# EAGLE design mapleSDuino-V0.1_011-eagle7 (EAGLE 7.6.0)
MAPLE-CUx Large Version
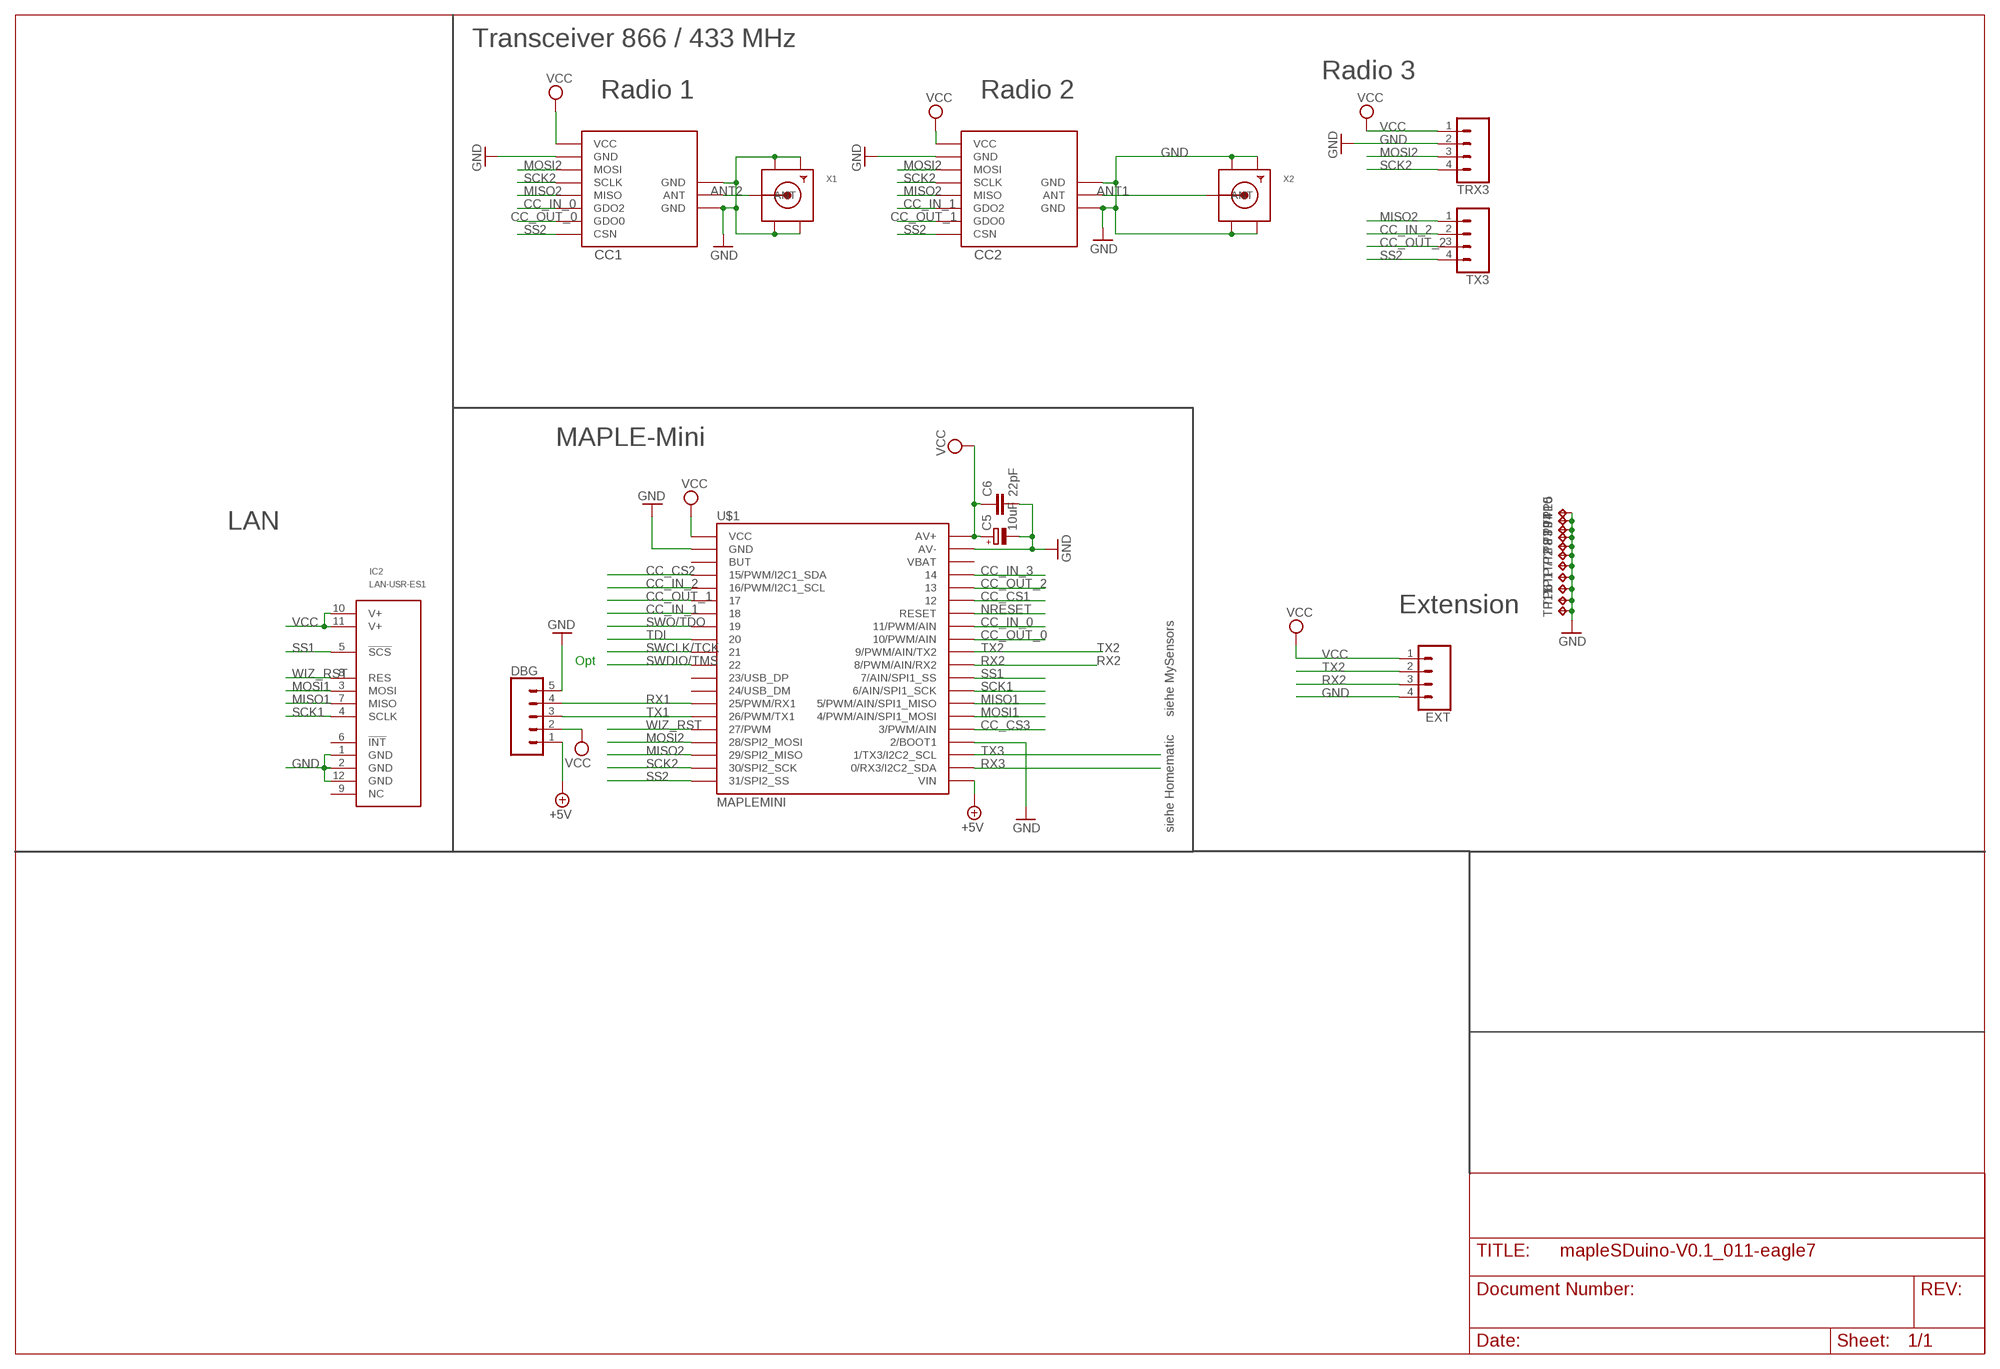
[diagram p0: schematic, sheet 1]

## Parts
C5  10uF  CPOL-EUR/2012-12W  [R/2012-12W]
C6  22pF  C-EUC0805  [C0805]
CC1  CC1101  CC1101_MODULE1SMD  [CC1101_MODULE1_SMD]
CC2  CC1101_MODULE1SMD  [CC1101_MODULE1_SMD]
DBG  CONN_05LOCK  [1X05_LOCK]
EXT  CONN_04PTH  [1X04]
IC2  LAN-USR-ES1  [USR-ES1]
TP1  TPTP06SQ  [TP06SQ]
TP2  TPTP06SQ  [TP06SQ]
TP3  TPTP06SQ  [TP06SQ]
TP4  TPTP06SQ  [TP06SQ]
TP5  TPTP06SQ  [TP06SQ]
TP6  TPTP06SQ  [TP06SQ]
TP7  TPTP06SQ  [TP06SQ]
TP8  TPTP06SQ  [TP06SQ]
TP9  TPTP06SQ  [TP06SQ]
TP10  TPTP06SQ  [TP06SQ]
TP11  TPTP06SQ  [TP06SQ]
TRX3  CONN_04PTH  [1X04]
TX3  CONN_04PTH  [1X04]
U$1  MAPLEMINI  [20-DIP]
X1  SMACONNECTOR_EDGE  [SMA_EDGELAUNCH]
X2  SMACONNECTOR_EDGE  [SMA_EDGELAUNCH]

## Nets
+5V [PWR]: DBG.1 U$1.21(VIN)
ANT1 [PWR]: CC2.ANT X2.P(ANT)
ANT2: CC1.ANT X1.P(ANT)
CC_CS1: U$1.35
CC_CS2: U$1.4(15/PWM/I2C1_SDA)
CC_CS3: U$1.25(3/PWM/AIN)
CC_IN_0: CC1.GDO2 U$1.33(11/PWM/AIN)
CC_IN_1: CC2.GDO2 U$1.7
CC_IN_2: TX3.2 U$1.5(16/PWM/I2C1_SCL)
CC_IN_3: U$1.37
CC_OUT_0: CC1.GDO0 U$1.32(10/PWM/AIN)
CC_OUT_1: CC2.GDO0 U$1.6
CC_OUT_2: TX3.3 U$1.36
GND [PWR]: C5.- C6.2 CC1.GND@0(GND) CC1.GND@1(GND) CC1.GND@2(GND) CC2.GND@0(GND) CC2.GND@1(GND) CC2.GND@2(GND) DBG.5 EXT.4 IC2.1(GND) IC2.2(GND) IC2.12(GND) TP1.TP TP2.TP TP3.TP TP4.TP TP5.TP TP6.TP TP7.TP TP8.TP TP9.TP TP10.TP TP11.TP TRX3.2 U$1.2(GND) U$1.24(2/BOOT1) U$1.39(AV-) X1.GND@1(GND4) X1.GND@2(GND3) X1.GND@3(GND2) X1.GND@4(GND1) X2.GND@1(GND4) X2.GND@2(GND3) X2.GND@3(GND2) X2.GND@4(GND1)
MISO1: IC2.7(MISO) U$1.27(5/PWM/AIN/SPI1_MISO)
MISO2: CC1.MISO CC2.MISO TX3.1 U$1.18(29/SPI2_MISO)
MOSI1: IC2.3(MOSI) U$1.26(4/PWM/AIN/SPI1_MOSI)
MOSI2: CC1.MOSI CC2.MOSI TRX3.3 U$1.17(28/SPI2_MOSI)
NRESET: U$1.34(RESET)
RX1: DBG.4 U$1.14(25/PWM/RX1)
RX2: EXT.3 U$1.30(8/PWM/AIN/RX2)
RX3: U$1.22(0/RX3/I2C2_SDA)
SCK1: IC2.4(SCLK) U$1.28(6/AIN/SPI1_SCK)
SCK2: CC1.SCLK CC2.SCLK TRX3.4 U$1.19(30/SPI2_SCK)
SS1: IC2.5(!SCS!) U$1.29(7/AIN/SPI1_SS)
SS2: CC1.CSN CC2.CSN TX3.4 U$1.20(31/SPI2_SS)
SWCLK/TCK: U$1.10
SWDIO/TMS: U$1.11
SWO/TDO: U$1.8
TDI: U$1.9
TX1: DBG.3 U$1.15(26/PWM/TX1)
TX2: EXT.2 U$1.31(9/PWM/AIN/TX2)
TX3: U$1.23(1/TX3/I2C2_SCL)
VCC [PWR]: C5.+ C6.1 CC1.VCC CC2.VCC DBG.2 EXT.1 IC2.10(V+) IC2.11(V+) TRX3.1 U$1.1(VCC) U$1.40(AV+)
WIZ_RST: IC2.8(RES) U$1.16(27/PWM)
Unconnected: IC2.6(!INT!) IC2.9(NC) U$1.3(BUT) U$1.12(23/USB_DP) U$1.13(24/USB_DM) U$1.38(VBAT)

## Notes on the sheet
- Transceiver 866 / 433 MHz
- Radio 3
- Radio 1 | Radio 2
- MAPLE-Mini
- LAN
- Extension
- Opt
- siehe MySensors
- siehe Homematic

## Library data of the parts
C5 = rcl:CPOL-EU: POLARIZED CAPACITOR, European symbol
C6 = rcl:C-EU: CAPACITOR, European symbol
CC1 CC2 = wireless:CC1101_MODULE1: CC1101 wireless module for 433/868 MHz (sold from Aliexpress). DIL version for mounting with pin header (and SMD soldering) and SMD only variant available.
DBG = SparkFun-Connectors:CONN_05: Multi connection point. Often used as Generic Header-pin footprint for 0.1 inch spaced/style header connections On any of the 0.1 inch spaced packages, you can populate with these: Break Away Headers - Straight <https://www.sparkfun.com/products/116> (PRT-00116) Break Away Male Headers - Right Angle <https://www.sparkfun.com/products/553> (PRT-00553) Female Headers <https://www.sparkfun.com/products/115> (PRT-00115) Break Away Headers - Machine Pin <https://www.sparkfun.com/products/117> (PRT-00117) Break Away Female Headers - Swiss Machine Pin <https://www.sparkfun.com/products/743> (PRT-00743) For SCREWTERMINALS and SPRING TERMINALS visit here: Screw Terimnals on SparkFun.com <https://www.sparkfun.com/search/results?term=Screw+Terminals> (5mm/3.5mm/2.54mm spacing) This device is also useful as a general connection point to wire up your design to another part of your project. Our various solder wires solder well into these plated through hole pads. Hook-Up Wire - Assortment (Stranded, 22 AWG) <https://www.sparkfun.com/products/11375> (PRT-11375) Hook-Up Wire - Assortment (Solid Core, 22 AWG) <https://www.sparkfun.com/products/11367> (PRT-11367) View the entire wire category on our website here <https://www.sparkfun.com/categories/141> Special notes: Molex polarized connector foot print use with SKU : PRT-08231 with associated crimp pins and housings. 1MM SMD Version SKU: PRT-10208
EXT TRX3 TX3 = SparkFun-Connectors:CONN_04: Multi connection point. Often used as Generic Header-pin footprint for 0.1 inch spaced/style header connections On any of the 0.1 inch spaced packages, you can populate with these: Break Away Headers - Straight <https://www.sparkfun.com/products/116> (PRT-00116) Break Away Male Headers - Right Angle <https://www.sparkfun.com/products/553> (PRT-00553) Female Headers <https://www.sparkfun.com/products/115> (PRT-00115) Break Away Headers - Machine Pin <https://www.sparkfun.com/products/117> (PRT-00117) Break Away Female Headers - Swiss Machine Pin <https://www.sparkfun.com/products/743> (PRT-00743) For SCREWTERMINALS and SPRING TERMINALS visit here: Screw Terimnals on SparkFun.com <https://www.sparkfun.com/search/results?term=Screw+Terminals> (5mm/3.5mm/2.54mm spacing) This device is also useful as a general connection point to wire up your design to another part of your project. Our various solder wires solder well into these plated through hole pads. Hook-Up Wire - Assortment (Stranded, 22 AWG) <https://www.sparkfun.com/products/11375> (PRT-11375) Hook-Up Wire - Assortment (Solid Core, 22 AWG) <https://www.sparkfun.com/products/11367> (PRT-11367) View the entire wire category on our website here <https://www.sparkfun.com/categories/141> Special notes: Molex polarized connector foot print use with SKU : PRT-08231 with associated crimp pins and housings. 1MM SMD Version SKU: PRT-10208; PROD_ID: CONN-09696
IC2 = Martin-Communication:LAN-USR-ES1
TP1-TP11 = testpad:TP: Test pad
U$1 = maplemini-small:MAPLEMINI
X1 X2 = adafruit:SMACONNECTOR: SMA Connector 90° DIP SMA Connector, 50 Ohm (4UConnector: 07259)

## Net classes
0 default: width 0.305 mm
1 PWR: width 0.406 mm

## Board
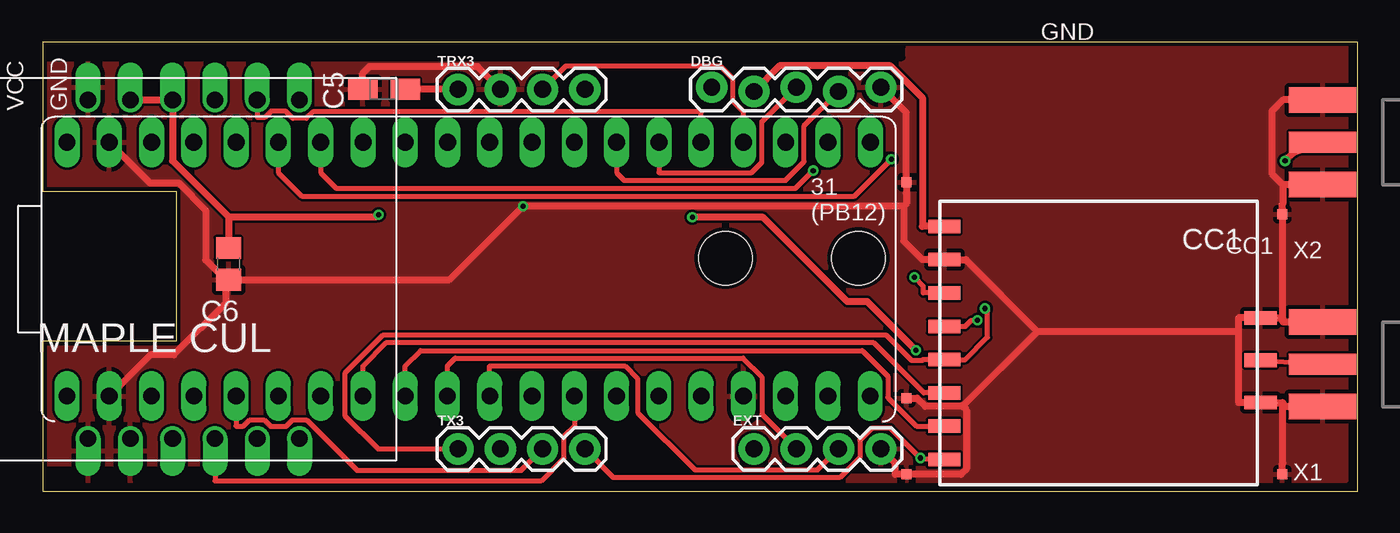
[diagram p1: board, top side]
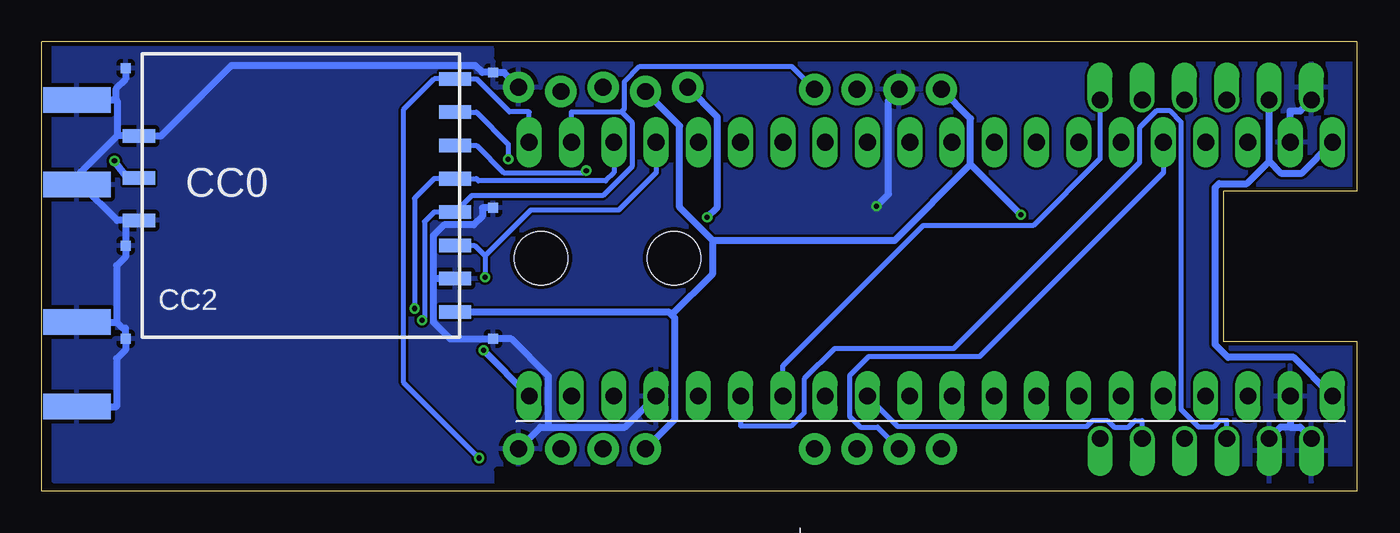
[diagram p2: board, bottom side, seen from below]

Size 79 x 27 mm. Coordinates in mm from the lower left corner, seen from the top.
Outline: 0,0 79,0 79,27 0,27 0,18 8,18 8,9 0,9 0,0
Copper layers (1*16): Top 0.035mm / dielectric 1.5mm / Bottom 0.035mm
Design rules "Fusion_eagle_rule_v1.1": minimum track width 6mil, minimum drill 12mil, track to track 6mil, track to pad 6mil, pad to pad 6mil, via to via 6mil, smd to smd 0mil, copper to edge 10mil, drill to drill 10mil, minimum pad ring 10mil, minimum via ring 6mil, stop-mask expansion 2mil, vias tented up to drill 100mil, thermal gap 10mil
Holes 3.2 mm at 49,14 41,14
tRestrict: 11 lines
bRestrict: 8 lines

### Footprints (pad centres in the part's own frame; a part is rotated, then mirrored left to right if it is on the bottom)
R/2012-12W = smd 1.75 x 1.26: + 1.275,0; - -1.275,0
C0805 = smd 1.3 x 1.5: 1 -0.95,0; 2 0.95,0
CC1101_MODULE1_SMD = smd 1.93 x 0.813: ANT 19,5.96; CSN 0,0; GDO0 0,2; GDO2 0,4; GND@0 0,12; GND@1 19,8.5; GND@2 19,3.42; MISO 0,6; MOSI 0,10; SCLK 0,8; VCC 0,14
1X05_LOCK = drill 1.016 pad 1.88: 1 0,0.127; 2 2.54,-0.127; 3 5.08,0.127; 4 7.62,-0.127; 5 10.16,0.127
1X04 = drill 1.016 pad 1.88: 1 0,0; 2 2.54,0; 3 5.08,0; 4 7.62,0
USR-ES1 = drill 1 pad 1.35 offset: 1 -10.16,5.715; 2 -10.16,3.175; 3 -10.16,0.635; 4 -10.16,-1.905; 5 -10.16,-4.445; 6 -10.16,-6.985; 7 10.16,-6.985; 8 10.16,-4.445; 9 10.16,-1.905; 10 10.16,0.635; 11 10.16,3.175; 12 10.16,5.715
TP06SQ = smd 0.6 x 0.6: TP 0,0
20-DIP = drill 1.016 pad 1.27 long: 1 -24.13,-7.62; 2 -21.59,-7.62; 3 -19.05,-7.62; 4 -16.51,-7.62; 5 -13.97,-7.62; 6 -11.43,-7.62; 7 -8.89,-7.62; 8 -6.35,-7.62; 9 -3.81,-7.62; 10 -1.27,-7.62; 11 1.27,-7.62; 12 3.81,-7.62; 13 6.35,-7.62; 14 8.89,-7.62; 15 11.43,-7.62; 16 13.97,-7.62; 17 16.51,-7.62; 18 19.05,-7.62; 19 21.59,-7.62; 20 24.13,-7.62 | drill 1 pad 1.27 long: 21 24.13,7.62; 22 21.59,7.62; 23 19.05,7.62; 24 16.51,7.62; 25 13.97,7.62; 26 11.43,7.62; 27 8.89,7.62; 28 6.35,7.62; 29 3.81,7.62; 30 1.27,7.62; 31 -1.27,7.62; 32 -3.81,7.62; 33 -6.35,7.62; 34 -8.89,7.62; 35 -11.43,7.62; 36 -13.97,7.62; 37 -16.51,7.62; 38 -19.05,7.62; 39 -21.59,7.62; 40 -24.13,7.62
SMA_EDGELAUNCH = smd 4.064 x 1.524: GND@1 2.032,-2.54; GND@2 2.032,2.54 | smd 4.064 x 1.524 bottom: GND@3 2.032,2.54; GND@4 2.032,-2.54 | smd 4.064 x 1.27: P 2.032,0

### Placement (x,y rotation side)
C5  20.5,24.13 0 top
C6  11.14,13.65 270 top
CC1  54.15,1.91 0 top
CC2  54.15,24.77 180 bottom
DBG  40.18,24.13 0 top
EXT  42.72,2.54 0 top
IC2  8.43,13.34 90 top
TP1  51.86,1.02 0 top
TP2  51.86,5.59 0 top
TP3  51.86,18.54 90 top
TP4  74.47,1.02 90 top
TP5  74.47,16.64 90 top
TP6  51.86,25.15 90 bottom
TP7  73.96,25.4 90 bottom
TP8  73.96,9.14 90 bottom
TP9  51.86,9.14 90 bottom
TP10  73.96,14.73 90 bottom
TP11  51.86,17.02 90 bottom
TRX3  24.94,24.13 0 top
TX3  24.94,2.54 0 top
U$1  25.57,13.34 180 bottom
X1  78.92,7.62 180 top
X2  78.92,20.95 180 top

### Tracks (layer width: path | path; a pad name or v marks a point on that pad's centre or on a via)
+5V  (via drill 0.3 pad 0.61)
  Top 0.406: v52.45,8.46 49.52,11.39 48.33,11.39 43.26,16.45 v39.01,16.45
  Bottom 0.406: U$1.21 v52.45,8.46 | v39.01,16.45 38.4,17.07 38.4,22.47 DBG.1
ANT1  (via drill 0.3 pad 0.61)
  Top 0.406: v74.62,19.83 75.13,20.32 X2.P
  Bottom 0.406: v74.62,19.83 74.6,19.81 73.84,18.8 CC2.ANT
ANT2
  Top 0.305: CC1.ANT X1.P
CC_IN_0
  Top 0.305: CC1.GDO2 52.92,5.91 49.92,8.9 20.6,8.9 19.23,7.53 U$1.33
CC_IN_1  (via drill 0.3 pad 0.61)
  Top 0.305: v46.28,19.26 45.2,18.18 17.63,18.18 16.68,19.13 U$1.7
  Bottom 0.305: v46.28,19.26 46.41,19.13 51.24,19.13 52.88,20.77 CC2.GDO2
CC_IN_2
  Bottom 0.305: U$1.5 11.61,19.13 22.65,8.08 29.32,8.08 30.46,6.94 30.46,4.5 29.81,3.84 28.78,3.84 TX3.2
CC_OUT_0
  Top 0.305: U$1.32 21.77,7.53 22.68,8.45 49.23,8.45 50.76,6.91 50.76,5.62 52.48,3.9 CC1.GDO0
CC_OUT_1  (via drill 0.3 pad 0.61)
  Top 0.305: v50.96,19.93 48.76,17.73 15.55,17.73 14.14,19.13 U$1.6
  Bottom 0.305: v50.96,19.93 50.96,20.85 52.88,22.77 CC2.GDO0
CC_OUT_2
  Top 0.305: U$1.36 11.61,3.9 12.04,3.9 12.43,4.29 13.29,4.29 13.68,3.9 14.61,3.9 15,4.29 15.83,4.29 18.86,1.25 28.73,1.25 TX3.3
GND  (via drill 0.3 pad 0.61)
  Top 0.406: C5.- 19.22,25.12 19.6,25.5 26.11,25.5 TRX3.2 | 51.72,17.12 51.72,15.02 52.83,13.9 CC1.GND@0 55.47,13.9 55.47,13.86 59.74,9.59 | 51.72,17.12 51.86,17.26 51.86,17.89 TP3.TP 51.86,19.2 51.86,22.73 DBG.5 | 51.72,17.12 v28.84,17.12 24.42,12.7 C6.2 10.97,12.7 | EXT.4 51.21,1.67 51.21,1.02 TP1.TP 55.16,1.02 55.47,1.33 55.47,4.88 55.25,5.1 | 55.25,5.1 53.01,5.1 52.52,5.59 TP2.TP | 59.74,9.59 55.25,5.1 | 71.83,9.59 71.83,5.33 CC1.GND@2 74.47,5.33 74.5,5.3 74.5,5.08 | 71.83,9.59 71.83,10.4 CC1.GND@1 73.81,10.4 74.47,10.4 | 71.83,9.59 59.74,9.59 | U$1.2 6.42,18.52 8.15,18.52 9.78,16.89 9.78,13.89 10.97,12.7 | 10.97,12.7 10.97,11.3 7.87,8.19 6.46,8.19 U$1.39 | 74.47,10.4 74.47,15.98 TP5.TP 74.47,16.96 74.47,17.29 74.5,17.32 74.5,18.41 | X2.GND@1 74.5,23.5 73.83,22.83 73.83,19.08 74.5,18.41 | X2.GND@2 74.5,18.41 | X1.GND@1 74.5,10.16 74.5,10.38 74.47,10.4 | TP4.TP 74.47,1.67 74.5,1.7 74.5,5.08 | X1.GND@2 74.5,5.08
  Bottom 0.406: v28.84,17.12 28.11,17.84 28.11,23.5 TRX3.2 | U$1.2 3.99,22.84 3.38,22.84 IC2.12 | TP7.TP 73.96,24.74 74.51,24.2 74.51,23.5 | 74.51,23.5 74.47,23.46 74.47,21.34 | 74.51,23.5 74.64,23.5 X2.GND@1 | 55.47,12.77 55.47,10.17 54.45,9.14 TP9.TP 50.77,9.14 48.55,6.92 48.55,3.84 | 3.99,3.85 3.39,3.85 IC2.1 | 3.99,3.85 3.99,3.99 U$1.39 | 3.99,3.85 4.58,3.85 IC2.2 | TP11.TP 52.52,17.02 52.52,16.52 53.04,15.99 54.83,15.99 55.47,15.35 55.47,12.77 | CC2.GND@0 55.47,12.77 | 48.55,3.84 43.96,3.84 U$1.24 | DBG.5 51.21,25.12 51.21,25.15 51.54,25.15 TP6.TP 52.52,25.15 52.94,25.57 67.61,25.57 71.83,21.34 CC2.GND@2 74.47,21.34 | 74.5,10.16 74.14,9.8 73.96,9.8 TP8.TP 73.96,8.49 74.5,7.96 74.5,5.08 X1.GND@2 | 74.5,10.16 74.5,13.54 73.96,14.08 TP10.TP 73.96,16.27 | X1.GND@1 74.5,10.16 | EXT.4 49.04,3.84 48.55,3.84 | 73.96,16.27 74.47,16.27 76.65,18.44 | CC2.GND@1 73.96,16.27 | 76.65,18.44 76.68,18.41 X2.GND@2 | 74.47,21.34 76.62,19.2 76.62,18.47 76.65,18.44
  pour Top: 0.17,26.67 78.28,26.67 78.28,0.64 0.17,0.64
  pour Bottom: 0.17,26.67 78.28,26.67 78.28,0.64 0.17,0.64
MISO1
  Bottom 0.305: IC2.7 15.41,19.95 19.42,15.95 26.05,15.95 34.47,7.53 U$1.27
MISO2  (via drill 0.3 pad 0.61)
  Top 0.305: TX3.1 20.13,2.54 18.13,4.54 18.13,7.08 20.41,9.36 50.69,9.36 52.21,7.84 52.82,7.84 52.88,7.91 CC1.MISO 55.42,7.91 56.75,9.23 56.75,10.82 v56.6,10.97
  Bottom 0.305: U$1.18 44.62,19.13 45.11,18.64 52.75,18.64 52.88,18.77 CC2.MISO 55.42,18.77 56.6,17.58 v56.6,10.97
MOSI1
  Bottom 0.305: IC2.3 7.79,4.23 8.23,4.23 8.62,3.85 9.48,3.85 10.53,4.9 10.53,22.17 11.2,22.84 12.02,22.84 13.04,21.82 13.04,19.74 24.21,8.57 31.37,8.57 33.2,6.74 33.2,4.7 33.99,3.9 37.01,3.9 U$1.26
MOSI2  (via drill 0.3 pad 0.61)
  Top 0.305: CC1.MOSI 52.88,11.9 52.88,12.32 v52.36,12.85 | U$1.17 42.09,22.78 41.45,23.42 41.45,24.78 40.7,25.52 31.41,25.52 TRX3.3
  Bottom 0.305: 52.36,14.14 v52.36,12.85 | 52.36,14.14 52.37,14.14 52.99,14.77 CC2.MOSI | 52.36,14.14 49.62,16.88 44.34,16.88 42.09,19.13 U$1.17
RX1
  Top 0.305: U$1.14 34.47,19.13 34.92,18.67 44.62,18.67 45.73,19.79 45.73,21.94 DBG.4
RX2
  Top 0.305: U$1.30 26.84,7.53 34.96,7.53 35.73,6.75 35.73,4.72 39.17,1.28 46.54,1.28 EXT.3
SCK1
  Top 0.305: IC2.4 10.34,0.61 29.92,0.61 31.29,1.98 31.29,3.27 31.92,3.9 U$1.28
SCK2  (via drill 0.3 pad 0.61)
  Top 0.305: v56.14,10.26 55.78,10.26 55.42,9.9 CC1.SCLK
  Bottom 0.305: 44.17,22.78 43.54,22.16 43.54,19.48 45.27,17.75 53.16,17.75 CC2.SCLK 55.42,16.77 55.99,16.19 55.99,10.41 v56.14,10.26 | 44.17,22.78 47.16,22.78 U$1.19 | 44.17,22.78 43.99,22.96 43.99,24.59 43.06,25.51 33.94,25.51 TRX3.4
SS1
  Bottom 0.305: IC2.5 12.88,4.23 13.31,4.23 13.7,3.85 14.56,3.85 14.97,4.26 15.86,4.26 16.22,3.9 27.57,3.9 U$1.29
SS2  (via drill 0.3 pad 0.61)
  Top 0.305: TX3.4 34.28,0.82 47.87,0.82 49.07,2.02 49.07,3.06 49.79,3.79 50.92,3.79 v52.72,1.99 52.79,1.99 52.88,1.91 CC1.CSN
  Bottom 0.305: v52.72,1.99 57.25,6.53 57.25,22.94 55.42,24.77 CC2.CSN 52.88,24.77 50.9,22.78 49.7,22.78 U$1.20
TX1
  Top 0.305: U$1.15 37.01,19.13 42.58,19.13 43.19,19.74 43.19,22.19 DBG.3
TX2
  Top 0.305: EXT.2 43.19,4.61 43.19,6.87 42.07,7.99 24.76,7.99 24.3,7.53 U$1.31
VCC  (via drill 0.3 pad 0.61)
  Top 0.406: 11.14,16.48 C6.1 | 11.14,16.48 7.79,19.84 IC2.10 IC2.11 | 11.14,16.48 20.05,16.48 v20.16,16.6 | TRX3.1 C5.+ | CC1.VCC 52.83,15.9 52.83,23.63 50.88,25.58 44.3,25.58 DBG.2
  Bottom 0.406: 41.14,10.59 40.97,10.41 40.97,4.29 EXT.1 | 41.14,10.59 41.32,10.77 52.83,10.77 CC2.VCC | 41.14,10.59 38.67,13.06 38.67,15.05 | 38.67,15.05 40.66,17.05 40.66,21.95 DBG.2 | 23.19,19.63 27.76,15.05 38.67,15.05 | v20.16,16.6 23.19,19.62 23.19,19.63 | 23.19,19.63 | 23.19,19.63 23.19,22.38 TRX3.1 | 5.26,19.81 IC2.11 | U$1.1 3.33,19.07 4.51,19.07 5.26,19.81 | U$1.40 3.77,8.04 7.73,8.04 8.49,8.8 8.49,18.25 8.28,18.47 6.6,18.47 5.26,19.81
WIZ_RST
  Top 0.305: IC2.8 12.88,22.44 13.31,22.44 13.7,22.82 14.57,22.82 15.01,22.39 15.82,22.39 16.22,22.78 39.55,22.78 U$1.16

### Text on the board
tNames: GND | TX | RX | GND | VCC | GND | 31 / (PB12) | CC1 | MAPLE CUL
bNames: MAPLE CUL | Small V2.0 / www.neuby.de | CC0 | + | TX | RX | GND